# EAGLE design STM32F030 - VGA minimal v5 (EAGLE 6.5.0)
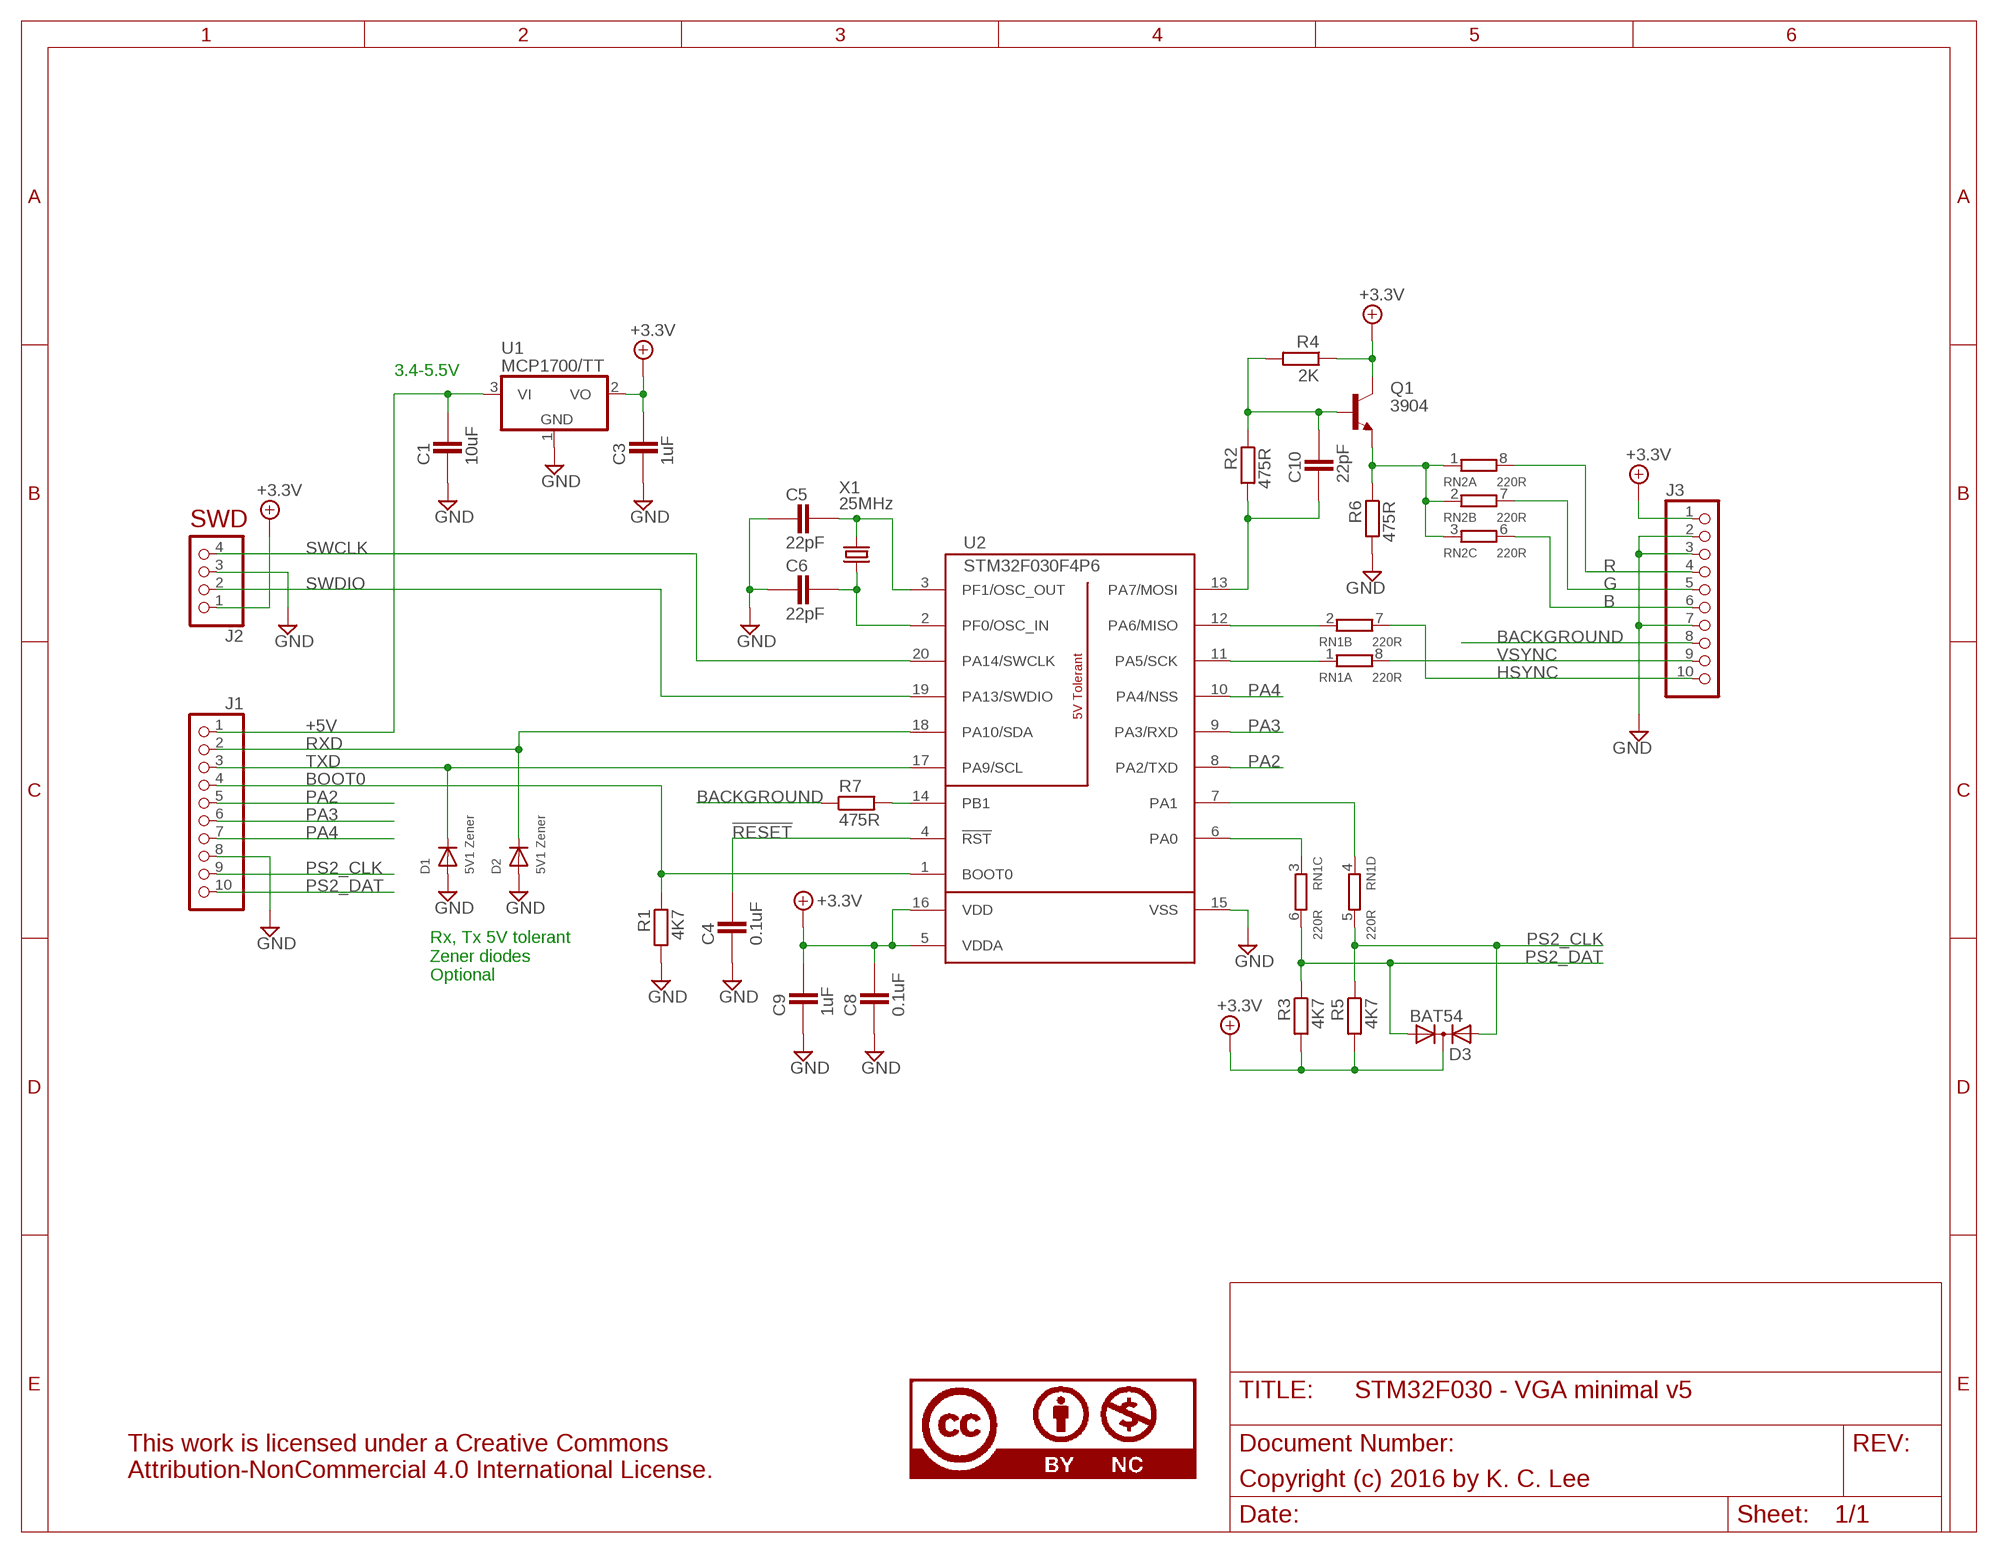
[diagram p0: schematic, sheet 1]

## Parts
C1  10uF  CAPACITOR_0805  [CAPC2012X145AN]
C3  1uF  CAPACITOR_0805  [CAPC2012X145AN]
C4  0.1uF  CAPACITOR_0603  [CAPC1608X92N]
C5  22pF  CAPACITOR_0603  [CAPC1608X92N]
C6  22pF  CAPACITOR_0603  [CAPC1608X92N]
C8  0.1uF  CAPACITOR_0603  [CAPC1608X92N]
C9  1uF  CAPACITOR_0603  [CAPC1608X92N]
C10  22pF  CAPACITOR_0603  [CAPC1608X92N]
D1  5V1 Zener  DIODESOD-123  [SOD-123]
D2  5V1 Zener  DIODESOD-123  [SOD-123]
D3  BAT54  A2K_SOT-23  [SOT95P280X135-3N]
J1  PINHD-1X10  [1X10]
J2  PINHD-1X4_2.54  [1X04]
J3  PINHD-1X10  [1X10]
LICENSE  CC-BY-NC  CC-BY-NC75%  [CC-BY-NC-75]
Q1  3904  NPN_SOT-23  [SOT95P280X135-3N]
R1  4K7  RESISTOR_0603  [RESC1608X55N]
R2  475R  RESISTOR_0603  [RESC1608X55N]
R3  4K7  RESISTOR_0603  [RESC1608X55N]
R4  2K  RESISTOR_0603  [RESC1608X55N]
R5  4K7  RESISTOR_0603  [RESC1608X55N]
R6  475R  RESISTOR_0603  [RESC1608X55N]
R7  475R  RESISTOR_0603  [RESC1608X55N]
RN1  220R  4R-NCAT16  [CAT16]
RN2  220R  4R-NCAT16  [CAT16]
U1  MCP1700/TT  [SOT95P280X135-3N]
U2  STM32F030F4P6  [TSSOP20]
X1  25MHz  CRYSTALSM49  [SM49]

## Nets
!RESET: C4.2 U2.4(!RST)
+3.3V: C3.2 C8.2 C9.2 D3.3(K) J2.1 J3.1 Q1.3(C) R3.2 R4.1 R5.2 U1.2(VO) U2.5(VDDA) U2.16(VDD)
+5V: C1.2 J1.1 U1.3(VI)
B: J3.6 RN2.6
BACKGROUND: J3.8 R7.1
BOOT0: J1.4 R1.1 U2.1(BOOT0)
G: J3.5 RN2.7
GND: C1.1 C3.1 C4.1 C5.1 C6.1 C8.1 C9.1 D1.A D2.A J1.8 J2.3 J3.2 J3.3 J3.7 R1.2 R6.2 U1.1(GND) U2.15(VSS)
HSYNC: J3.10 RN1.7
N$1: Q1.2(E) R6.1 RN2.1 RN2.2 RN2.3
N$2: RN1.2 U2.12(PA6/MISO)
N$3: RN1.4 U2.7(PA1)
N$4: R7.2 U2.14(PB1)
N$5: C5.2 U2.3(PF1/OSC_OUT) X1.2
N$6: C6.2 U2.2(PF0/OSC_IN) X1.1
N$8: RN1.1 U2.11(PA5/SCK)
N$9: RN1.3 U2.6(PA0)
N$11: C10.2 Q1.1(B) R2.1 R4.2
N$12: C10.1 R2.2 U2.13(PA7/MOSI)
PA2: J1.5 U2.8(PA2/TXD)
PA3: J1.6 U2.9(PA3/RXD)
PA4: J1.7 U2.10(PA4/NSS)
PS2_CLK: D3.2(A2) J1.9 R5.1 RN1.5
PS2_DAT: D3.1(A1) J1.10 R3.1 RN1.6
R: J3.4 RN2.8
RXD: D2.C J1.2 U2.18(PA10/SDA)
SWCLK: J2.4 U2.20(PA14/SWCLK)
SWDIO: J2.2 U2.19(PA13/SWDIO)
TXD: D1.C J1.3 U2.17(PA9/SCL)
VSYNC: J3.9 RN1.8
Unconnected: RN2.4 RN2.5

## Notes on the sheet
- 3.4-5.5V
- SWD
- Rx, Tx 5V tolerant
  Zener diodes
  Optional
- Copyright (c) 2016 by K. C. Lee

## Library data of the parts
C1 = ipc-7351-capacitor:CAPACITOR_; PARTNO: 10UF/10V X5R 0805
C3 = ipc-7351-capacitor:CAPACITOR_; PARTNO: 1UF, 0805
C4 C8 = ipc-7351-capacitor:CAPACITOR_; PARTNO: 0.1UF, 0603
C5 C6 C10 = ipc-7351-capacitor:CAPACITOR_; PARTNO: 22PF, 0603
C9 = ipc-7351-capacitor:CAPACITOR_; PARTNO: 1UF, 0603
D1 D2 = Misc Passives:DIODE: Diode SMADIODE - SMA Surface Mount Package 20V 1A Schottky Diode Digikey (500mV @ 1A, 500uA Vr @ 20V): 641-1014-6-ND SOD-123 30V 500mA (430mV Vf, 130uA Vr @ 30V) Schottky Diode - Digikey: B0530W-FDICT-ND SOD-323 10V 570mA (380mV Vf, 3ns) Schottky Diode - Digikey: ZLLS410CT-ND SOD-523 30V 30mA Schottky Diode (RB751S-40TE61) - Digikey: RB751S-40TE61CT-ND SOT23-R/W - SOT23 Package (R = Solder Paste/Reflow Ovens, W = Hand-Soldering) BAT54Film 40V 300mA - Digikey: 497-7162-1-ND DO-1N4148 Through Hole Small Current Diode (any model); PARTNO: BZT52C5V1
D3 = ipc-7351-diode:A2K_; PARTNO: BAT54
J1 J3 = Misc Conn:PINHD-1X10: PIN HEADER; PARTNO: 0.1 IN HEADER 1X10
J2 = Misc Conn:PINHD-1X4: PIN HEADER; PARTNO: 0.1 IN HEADER 1X4
LICENSE = Misc logo:CC-BY-NC; PARTNO: LICENSE
Q1 = ipc-7351-transistor:NPN_; PARTNO: MMBT3904
R1 R3 R5 = ipc-7351-resistor:RESISTOR_; PARTNO: 4K7, 0603
R2 R6 R7 = ipc-7351-resistor:RESISTOR_; PARTNO: 475R, 0603
R4 = ipc-7351-resistor:RESISTOR_; PARTNO: 2K, 0603
RN1 RN2 = Misc Passives:4R-N: Array Chip Resistor Source: RS Component / Phycomp; OC_FARNELL: unknown; OC_NEWARK: unknown; PARTNO: CAT16-221J4
U1 = Misc Power:MCP1700; PARTNO: MCP1700T-3302E/TT
U2 = Misc Processor:STM32F030F4P6; PARTNO: STM32F030F4P6
X1 = crystal:CRYSTAL: CRYSTAL; OC_FARNELL: unknown; OC_NEWARK: unknown; PARTNO: 25MHZ FUND. HC49

## Board
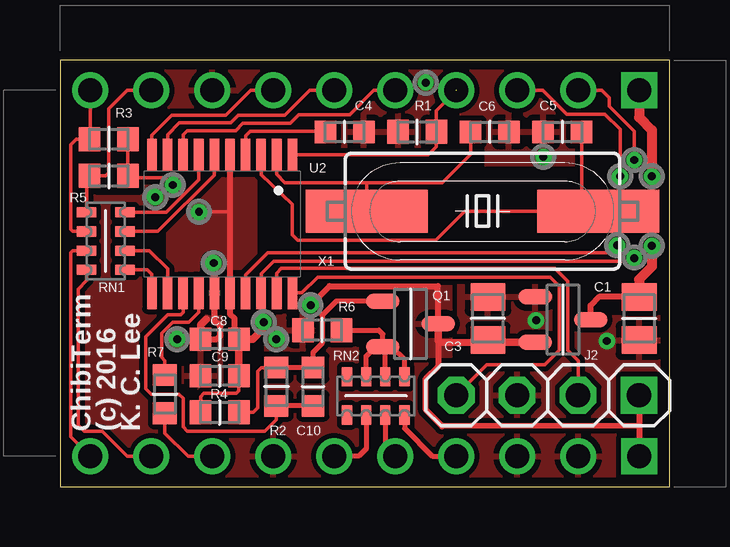
[diagram p1: board, top side]
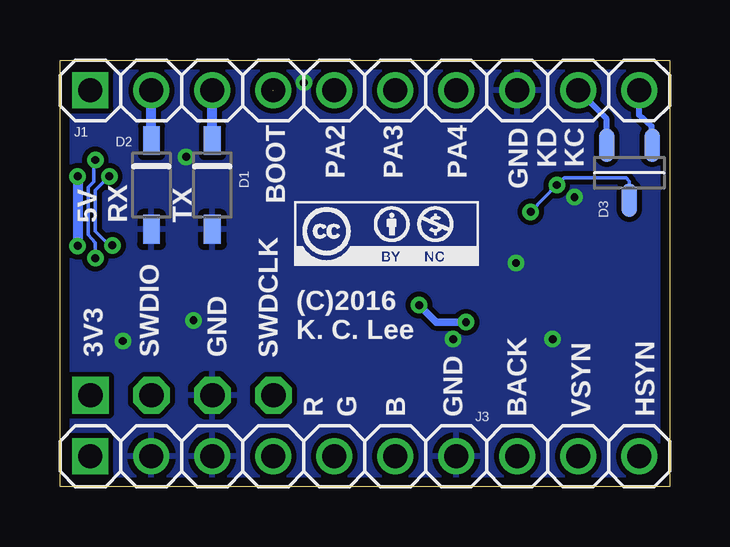
[diagram p2: board, bottom side, seen from below]

Size 25.4 x 17.78 mm. Coordinates in mm from the lower left corner, seen from the top.
Outline: 0,0 25.4,0 25.4,17.78 0,17.78 0,0
Copper layers (1*16): Top 0.0356mm / dielectric 1.5011mm / Bottom 0.0356mm
Design rules "oshpark-2layer": minimum track width 6mil, minimum drill 13mil, track to track 6mil, track to pad 6mil, pad to pad 6mil, via to via 6mil, smd to smd 6mil, copper to edge 15mil, drill to drill 6mil, minimum pad ring 7mil, minimum via ring 7mil, stop-mask expansion 4mil, vias tented up to drill 0mil, thermal gap 10mil
tRestrict: 11 lines

### Footprints (pad centres in the part's own frame; a part is rotated, then mirrored left to right if it is on the bottom)
CAPC2012X145AN = smd 1.15 x 1.45: 1 -0.9,0; 2 0.9,0
CAPC1608X92N = smd 0.9 x 0.95: 1 -0.8,0; 2 0.8,0
SOD-123 = smd 1.2 x 0.7: A 1.85,0; C -1.85,0
SOT95P280X135-3N = smd 1.4 x 0.65: 1 -1.15,0.95; 2 -1.15,-0.95; 3 1.15,0
1X10 = drill 1 square: 1 -11.43,0 | drill 1: 2 -8.89,0; 3 -6.35,0; 4 -3.81,0; 5 -1.27,0; 6 1.27,0; 7 3.81,0; 8 6.35,0; 9 8.89,0; 10 11.43,0
1X04 = drill 1.016 square: 1 -3.81,0 | drill 1.016 octagon: 2 -1.27,0; 3 1.27,0; 4 3.81,0
RESC1608X55N = smd 0.9 x 1: 1 -0.8,0; 2 0.8,0
CAT16 = smd 0.425 x 0.8: 1 -1.2,-0.8; 2 -0.4,-0.8; 3 0.4,-0.8; 4 1.2,-0.8; 5 1.2,0.8; 6 0.4,0.8; 7 -0.4,0.8; 8 -1.2,0.8
TSSOP20 = smd 0.4 x 1.35: 1 -2.925,-2.875; 2 -2.275,-2.875; 3 -1.625,-2.875; 4 -0.975,-2.875; 5 -0.325,-2.875; 6 0.325,-2.875; 7 0.975,-2.875; 8 1.625,-2.875; 9 2.275,-2.875; 10 2.925,-2.875; 11 2.925,2.875; 12 2.275,2.875; 13 1.625,2.875; 14 0.975,2.875; 15 0.325,2.875; 16 -0.325,2.875; 17 -0.975,2.875; 18 -1.625,2.875; 19 -2.275,2.875; 20 -2.925,2.875
SM49 = smd 5.08 x 1.778: 1 -4.826,0; 2 4.826,0

### Placement (x,y rotation side)
C1  24.13,7.01 90 top
C3  17.83,7.01 270 top
C4  11.86,14.78 180 top
C5  20.93,14.78 0 top
C6  17.91,14.78 180 top
C8  6.65,6.15 0 top
C9  6.65,4.62 0 top
C10  10.54,4.17 90 top
D1  19.05,12.57 270 bottom
D2  21.59,12.57 270 bottom
D3  1.68,13.08 270 bottom
J1  12.7,16.51 0 bottom
J2  20.32,3.81 180 top
J3  12.7,1.27 0 bottom
LICENSE  15.62,9.22 0 bottom
Q1  14.61,6.78 0 top
R1  14.88,14.78 180 top
R2  9.02,4.17 270 top
R3  2.03,14.48 0 top
R4  6.65,3.1 0 top
R5  2.03,12.95 0 top
R6  10.92,6.53 180 top
R7  4.37,3.86 90 top
RN1  1.91,10.24 90 top
RN2  13.16,3.78 180 top
U1  20.95,6.96 0 top
U2  6.76,10.95 180 top
X1  17.6,11.48 0 top

### Tracks (layer width: path | path; a pad name or v marks a point on that pad's centre or on a via)
!RESET
  Top 0.152: U2.4 7.73,14.62 7.92,14.81 10.74,14.81 10.73,14.78 C4.2
+3.3V  (via drill 0.33)
  Top 0.152: R4.1 5.86,3.75 5.99,3.89 7.34,3.89 7.46,4 C9.2 | R3.2 R5.2 2.85,12.95 2.9,12.88 4.39,12.88 v4.7,12.57 | v5.79,11.46 7.03,11.46 7.08,11.51
  Top 0.254: U2.5 7.08,11.51 U2.16 7.08,7.19 7.26,7.01 7.26,6.37 C8.2 | J2.1 24.13,2.54 | 24.13,2.54 J3.1 | 24.13,2.54 15.93,2.52 15.24,3.2 15.24,4.51 15.76,5.03 15.76,6.1 15.79,6.01 | v10.44,7.57 11.23,8.36 15.75,8.36 15.76,7.31 Q1.3
  Top 0.305: U1.2 17.93,6.01 C3.2 17.64,6.11 17.55,6.02 15.79,6.01 | C8.2 7.47,6.16 7.53,6.16 | v8.48,6.86 8.46,6.58 8.03,6.15 C8.2 | C8.2 C9.2 | Q1.3 15.76,6.1
  Bottom 0.152: v5.79,11.46 v4.7,12.57 4.39,12.88 1.82,12.88 1.68,12.74 D3.3
  Bottom 0.305: v10.44,7.57 9.73,6.86 v8.48,6.86
  pour Top (isolate 0.203): 4.5,10.57 6.76,12.83 8.15,12.83 8.15,9.09 7.04,9.09 7.04,9.35 arc90 6.4,9.93 6.32,9.93 arc90 5.77,9.32 5.77,9.02 4.5,9.02
  pour Top (isolate 0.254): 16.28,5.41 14.61,5.44 14.61,8.43 16.28,8.43
+5V  (via drill 0.33)
  Top 0.254: C1.2 22.46,7.91 22.11,7.55 U1.3
  Top 0.406: J1.1 24.13,15.39 24.66,14.86 v24.66,12.93 | v24.66,10.03 24.66,9.17 24.13,8.64 C1.2
  Bottom 0.406: v24.66,12.93 v24.66,10.03
B
  Top 0.203: RN2.6 12.76,1.58 12.45,1.27 J3.6
BACKGROUND
  Top 0.152: R7.1 4.37,2.23 5.33,1.27 J3.8
BOOT0  (1 unrouted)
  Top 0.152: 16.52,16.5 | 16.52,16.5 15.68,15.66 R1.1 15.68,14.16 15.35,13.82 U2.1
G
  Top 0.203: J3.5 13.56,1.68 RN2.7
GND  (via drill 0.33)
  Top 0.254: C8.1 6.53,6.15 6.68,6.3 6.68,6.71 6.58,6.81 | 6.43,8.64 6.43,6.86
  Top 0.305: v6.4,9.32 6.43,9.35 6.43,8.64 | C8.1 5.86,6.74 6.1,6.99
  other vias: 15.24,16.84 20.14,13.74 19.84,6.93 22.78,6.07 9.02,6.15 4.88,6.15 3.96,12.06
  pour Bottom (isolate 0.203, rank 2): 0,0 0,17.78 25.4,17.78 25.4,0
  pour Top (isolate 0.203, rank 2): 25.4,0 25.4,17.78 0,17.78 0,0
HSYNC
  Top 0.152: J3.10 0.46,2.08 0.46,9.75 0.54,9.84 RN1.7
N$1
  Top 0.203: RN2.2 13.56,5.83 Q1.2 | R6.1 13.28,6.53 13.46,6.36 Q1.2 | Q1.2 13.15,5.83 12.76,5.44 RN2.3 | Q1.2 13.83,5.83 14.36,5.3 RN2.1
N$2
  Top 0.152: U2.12 4.48,9.08 3.73,9.84 RN1.2
N$3
  Top 0.152: RN1.4 4.43,11.44 5.78,12.79 U2.7
N$4
  Top 0.152: U2.14 5.78,7.28 5.36,6.86 4.7,6.86 4.24,6.4 4.24,5.38 4.37,5.26 R7.2
N$5
  Top 0.152: 21.89,11.48 16.87,11.48 15.65,10.26 9.91,10.26 9.68,10.49 9.68,11.76 8.38,13.01 U2.3 | 21.89,11.48 X1.2 | C5.2 21.73,11.32 21.89,11.48
N$6
  Top 0.152: U2.2 9.03,13.02 9.37,12.68 12.78,12.68 | 12.78,12.68 15.93,12.68 17.11,13.86 C6.2 | X1.1 12.78,12.68
N$8
  Top 0.152: RN1.1 3.64,9.04 3.83,8.85 3.83,8.1 U2.11
N$9
  Top 0.152: RN1.3 4.08,10.64 6.43,12.98 U2.6
N$11
  Top 0.152: R2.1 8.39,4.97 8.24,4.81 8.24,3.29 8.05,3.1 R4.2
  Top 0.203: R2.1 C10.2 10.54,5.59 10.92,5.97 10.92,7.14 11.52,7.73 Q1.1
N$12
  Top 0.152: U2.13 5.13,7.26 5.03,7.16 4.5,7.16 3.58,6.25 3.58,4.09 3.81,3.86 4.95,3.86 5.13,3.68 5.13,2.49 5.31,2.31 8.53,2.31 9.02,2.79 R2.2
  Top 0.203: C10.1 R2.2
PA2
  Top 0.152: U2.8 5.13,14.66 5.31,14.83 7.32,14.83 7.62,15.14 9.6,15.14 9.96,15.49 12.06,15.49 13.08,16.51 J1.5
PA3
  Top 0.152: U2.9 4.48,14.67 4.98,15.16 7.11,15.16 7.42,15.47 9.37,15.47 10.41,16.51 J1.6
PA4
  Top 0.152: U2.10 3.83,14.65 4.65,15.47 6.91,15.47 7.95,16.51 J1.7
PS2_CLK
  Top 0.152: J1.9 2.79,16.51 2.03,15.75 2.03,13.08 1.91,12.95 R5.1 1.12,12.95 1.12,11.46 1.23,11.49 RN1.5
  Bottom 0.254: J1.9 2.63,15.33 D3.2
PS2_DAT
  Top 0.152: J1.10 1.27,14.52 R3.1 0.69,14.48 0.46,14.25 0.46,10.72 0.54,10.64 RN1.6
  Bottom 0.254: D3.1 0.75,15.02 1.27,15.49 J1.10
R
  Top 0.203: RN2.8 14.36,2.43 15.52,1.27 J3.4
RXD  (via drill 0.33)
  Top 0.152: U2.18 8.38,8.86 8.91,9.4 23.8,9.4 v23.93,9.53 | v23.93,13.61 23.93,14.81 22.89,15.85 22.89,16.2 22.58,16.51 J1.2
  Bottom 0.152: v23.93,9.53 23.93,10.16 24.23,10.49 24.23,12.47 24,12.7 24,13.54 v23.93,13.61
  Bottom 0.406: D2.C J1.2
SWCLK
  Top 0.152: J2.4 17.78,5.08 20.19,5.08 20.8,5.69 20.8,8.36 20.42,8.74 10.74,8.74 10.08,8.07 U2.20
SWDIO
  Top 0.152: U2.19 9.03,8.9 9.22,9.09 20.62,9.09 21.16,8.56 21.16,5.69 21.59,5.26 J2.2
TXD  (via drill 0.33)
  Top 0.152: U2.17 7.73,8.82 8.66,9.75 22.91,9.75 v23.22,10.06 | v23.34,12.93 23.34,14.88 22.71,15.52 21.11,15.52 20.12,16.51 J1.3
  Bottom 0.152: v23.22,10.06 23.34,10.06 23.93,10.64 23.93,12.34 v23.34,12.93
  Bottom 0.406: D1.C J1.3
VSYNC
  Top 0.152: J3.9 2.79,1.27 1.75,2.31 1.02,2.31 0.76,2.56 0.76,8.23 1.1,8.6 RN1.8

### Text on the board
tPlace: ChibiTerm | (c) 2016 | K. C. Lee
bPlace: KC | KD | GND | PA4 | PA3 | PA2 | BOOT | TX | RX | 5V | (C)2016 / K. C. Lee | SWDCLK | GND | SWDIO | 3V3 | HSYN | VSYN | BACK | GND | B | G | R